# EAGLE schematic Solar_Points (EAGLE 9.6.2)
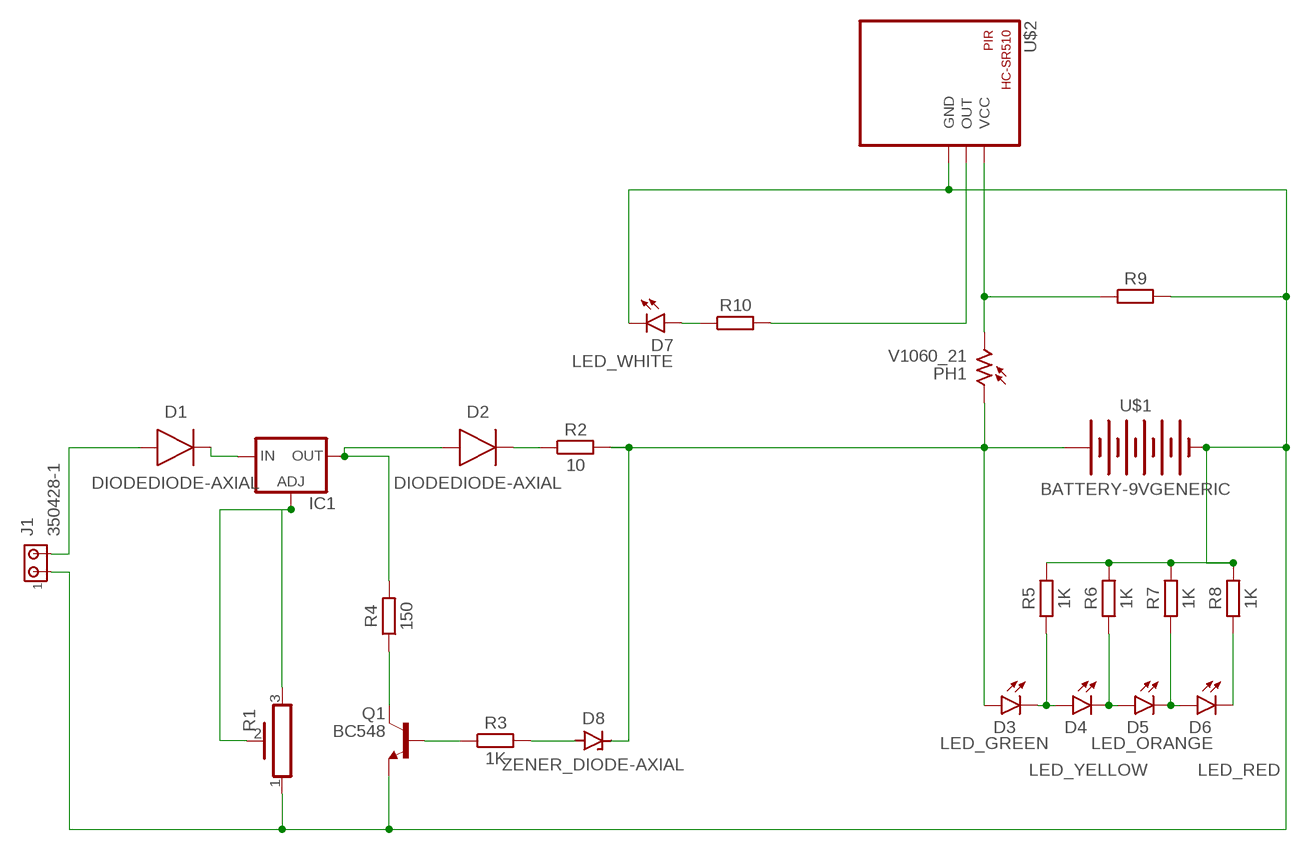
[diagram p0: schematic, sheet 1]

## Parts
D1  DIODEDIODE-AXIAL  [DIODE-AXIAL]
D2  DIODEDIODE-AXIAL  [DIODE-AXIAL]
D3  LED_GREEN  LED_RADIAL_GREEN  [LEDRD254W60D565H860B_G]
D4  LED_YELLOW  LED_RADIAL_YELLOW  [LEDRD254W60D565H860B_Y]
D5  LED_ORANGE  LED_RADIAL_ORANGE  [LEDRD254W60D565H860B_O]
D6  LED_RED  LED_RADIAL_RED  [LEDRD254W60D565H860B]
D7  LED_WHITE  LED_RADIAL_WHITE  [LEDRD254W60D565H860B_W]
D8  ZENER_DIODE-AXIAL  [DIODE-AXIAL]
IC1  LM317TL  [317TL]
J1  350428-1  [350428-1]
PH1  V1060_21  [TO-5_V10]
Q1  BC548  NPN__TO92  [TO92]
R1  POT_PV36Z  [PV36Z]
R2  10  RESISTOR__AXIAL-11.7MM-PITCH  [RESAD1176W63L850D250B]
R3  1K  RESISTOR__AXIAL-11.7MM-PITCH  [RESAD1176W63L850D250B]
R4  150  RESISTOR__AXIAL-11.7MM-PITCH  [RESAD1176W63L850D250B]
R5  1K  RESISTOR__AXIAL-11.7MM-PITCH  [RESAD1176W63L850D250B]
R6  1K  RESISTOR__AXIAL-11.7MM-PITCH  [RESAD1176W63L850D250B]
R7  1K  RESISTOR__AXIAL-11.7MM-PITCH  [RESAD1176W63L850D250B]
R8  1K  RESISTOR__AXIAL-11.7MM-PITCH  [RESAD1176W63L850D250B]
R9  RESISTOR__AXIAL-11.7MM-PITCH  [RESAD1176W63L850D250B]
R10  RESISTOR__AXIAL-11.7MM-PITCH  [RESAD1176W63L850D250B]
U$1  BATTERY-9VGENERIC  [BATTERY-GENERIC]
U$2  HC-SR501  [HC-SR501]

## Nets
N$1: D1.1(A) J1.2
N$2: Q1.1(C) R4.1
N$3: Q1.2(B) R3.1
N$4: D1.2(C) IC1.3(IN)
N$5: D3.2(C) D4.1(A) R5.1
N$6: D2.2(C) R2.1
N$7: D3.1(A) D8.2(C) PH1.1 R2.2 U$1.+
N$8: D7.1(A) R10.1
N$9: D4.2(C) D5.1(A) R6.1
N$10: PH1.2 R9.1 U$2.VCC
N$11: D5.2(C) D6.1(A) R7.1
N$12: R10.2 U$2.OUT
N$13: D6.2(C) R8.1
N$14: D7.2(C) J1.1 Q1.3(E) R1.1 R5.2 R6.2 R7.2 R8.2 R9.2 U$1.- U$2.GND
N$15: D8.1(A) R3.2
N$16: D2.1(A) IC1.2(OUT) R4.2
N$17: IC1.1(ADJ) R1.2 R1.3

## Library data of the parts
D1 D2 = Tinkercad:DIODE: Diode Rectifier - Generic
D3-D7 = Tinkercad:LED_RADIAL: LED - Generic; CATEGORY: Opto-Electronic; SUB-CATEGORY: LED
D8 = Tinkercad:ZENER: Zener Diode - Generic
IC1 = v-reg:LM317TL: VOLTAGE REGULATOR
J1 = con-amp:350428-1: Universal MATE-N-LOK .250" Centerline, 600 V, 19 - 36 A max Source: http://catalog.tycoelectronics.com/ .. ENG_CD_350428_Y.pdf
PH1 = photo-elements:?1060*: Sensor Street Light control Source: http://optoelectronics.perkinelmer.com/content/Datasheets/DTS_PhotocellsB1060.pdf
Q1 = Tinkercad:NPN: NPN - Generic; CATEGORY: Transistor; SUB-CATEGORY: BJT; TYPE: NPN; VALUE: NPN
R1 = Tinkercad:POT: Rectangular Trimmer Potentiometers - PV36 Series Datasheet <https://www.bourns.com/docs/Product-Datasheets/pv36.pdf>; CATEGORY: Resistor; DESCRIPTION: Lead Sealed Type Multiturn PV36 Series; MANUFACTURER: BOURNS; MPN: PV36Z; OPERATING_TEMPERATURE: -55 to +125 °C; PART_STATUS: Active; ROHS_COMPLIANCE: RoHS Compliant; SERIES: PV36; SUB-CATEGORY: Trimpot; TYPE: Lead Sealed
R2-R10 = Tinkercad:RESISTOR: Resistor Fixed - Generic; CATEGORY: Resistor; SUB-CATEGORY: Fixed
U$1 = Tinkercad:BATTERY-9V
U$2 = Sensors_PIR_Lux:HC-SR501: PIR Module HC-SR501